# EAGLE design Keyboard01 (EAGLE 4.14)
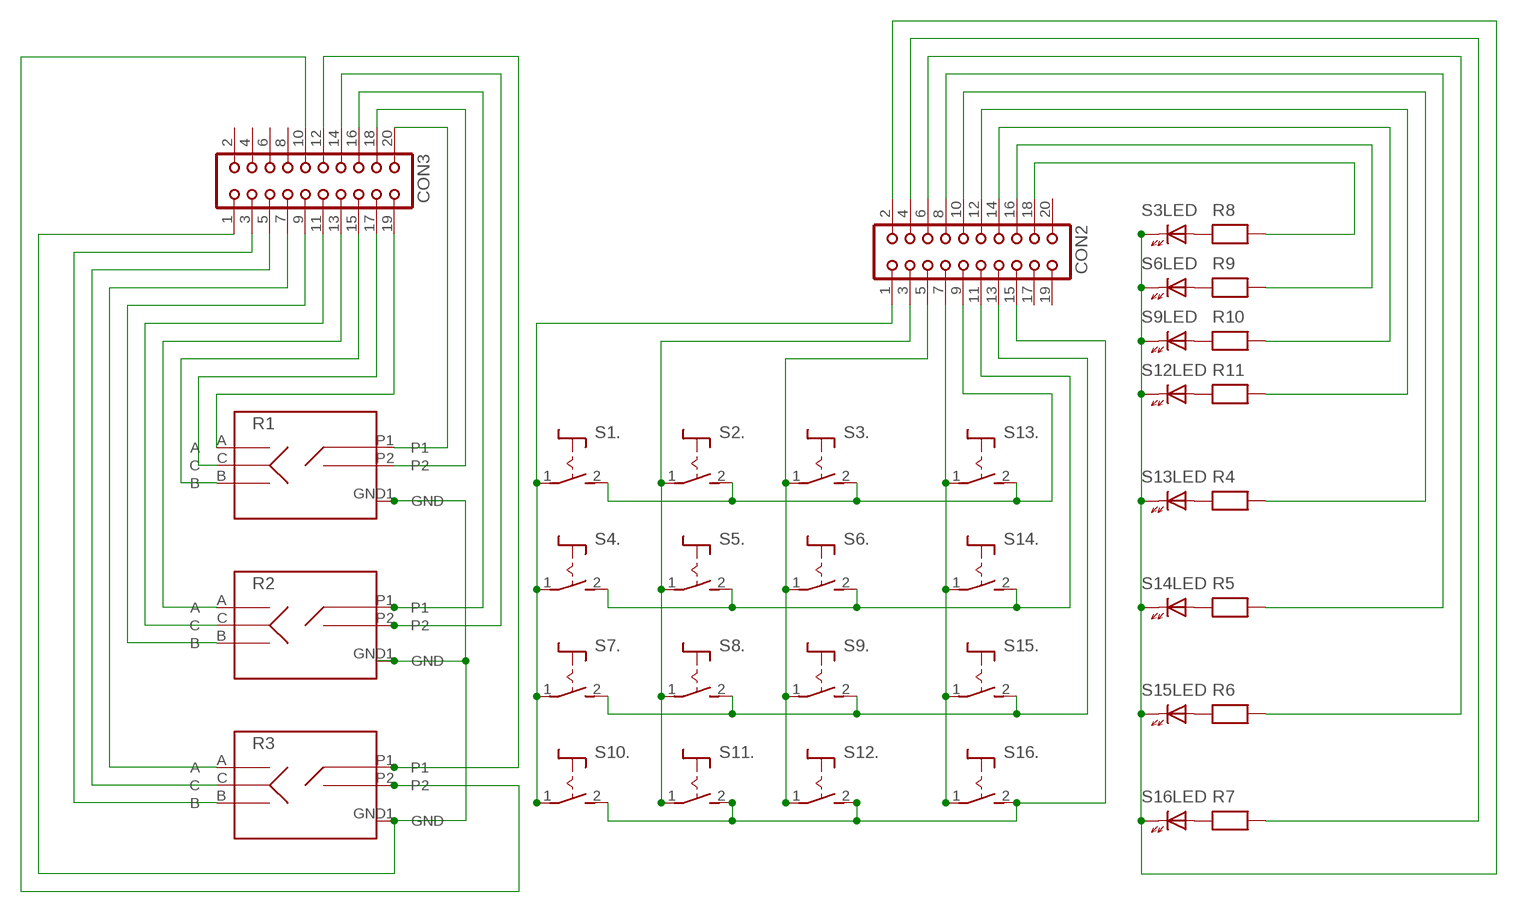
[diagram p0: schematic, sheet 1]

## Parts
CON2  CON20  [CON20]
CON3  CON20  [CON20]
R1  DDM_427  [DDM427]
R2  DDM_427  [DDM427]
R3  DDM_427  [DDM427]
R4  RESEU-10  [R-10]
R5  RESEU-10  [R-10]
R6  RESEU-10  [R-10]
R7  RESEU-10  [R-10]
R8  RESEU-10  [R-10]
R9  RESEU-10  [R-10]
R10  RESEU-10  [R-10]
R11  RESEU-10  [R-10]
S1  MARQ6425  [MARQ6425]
S2  MARQ6425  [MARQ6425]
S3  MARQ6425  [MARQ6425]
S4  MARQ6425  [MARQ6425]
S5  MARQ6425  [MARQ6425]
S6  MARQ6425  [MARQ6425]
S7  MARQ6425  [MARQ6425]
S8  MARQ6425  [MARQ6425]
S9  MARQ6425  [MARQ6425]
S10  MARQ6425  [MARQ6425]
S11  MARQ6425  [MARQ6425]
S12  MARQ6425  [MARQ6425]
S13  MARQ6425  [MARQ6425]
S14  MARQ6425  [MARQ6425]
S15  MARQ6425  [MARQ6425]
S16  MARQ6425  [MARQ6425]

## Nets
N$1: CON2.1 S1.1(.:P) S4.1(.:P) S7.1(.:P) S10.1(.:P)
N$2: CON2.3 S2.1(.:P) S5.1(.:P) S8.1(.:P) S11.1(.:P)
N$3: CON2.5 S3.1(.:P) S6.1(.:P) S9.1(.:P) S12.1(.:P)
N$4: CON2.7 S13.1(.:P) S14.1(.:P) S15.1(.:P) S16.1(.:P)
N$5: CON2.9 S1.2(.:S) S2.2(.:S) S3.2(.:S) S13.2(.:S)
N$6: CON2.11 S4.2(.:S) S5.2(.:S) S6.2(.:S) S14.2(.:S)
N$7: CON2.13 S7.2(.:S) S8.2(.:S) S9.2(.:S) S15.2(.:S)
N$8: CON2.15 S10.2(.:S) S11.2(.:S) S12.2(.:S) S16.2(.:S)
N$9: CON2.10 R4.2
N$10: CON3.17 R1.C
N$11: CON3.15 R1.B
N$12: CON3.13 R2.A
N$13: CON3.11 R2.C
N$14: CON3.9 R2.B
N$15: CON3.7 R3.A
N$16: CON3.5 R3.C
N$17: CON3.3 R3.B
N$18: CON3.20 R1.P1
N$19: CON3.18 R1.P2
N$20: CON3.16 R2.P1
N$21: CON3.14 R2.P2
N$22: CON3.12 R3.P1
N$23: CON3.10 R3.P2
N$24: R4.1 S13.A(LED:A)
N$25: R5.1 S14.A(LED:A)
N$26: R6.1 S15.A(LED:A)
N$27: R7.1 S16.A(LED:A)
N$28: CON2.2 S3.K(LED:K) S6.K(LED:K) S9.K(LED:K) S12.K(LED:K) S13.K(LED:K) S14.K(LED:K) S15.K(LED:K) S16.K(LED:K)
N$29: R8.1 S3.A(LED:A)
N$30: CON2.8 R5.2
N$31: CON2.6 R6.2
N$32: CON2.4 R7.2
N$33: CON3.1 R1.GND1(GND) R2.GND1(GND) R3.GND1(GND)
N$34: R9.1 S6.A(LED:A)
N$35: R10.1 S9.A(LED:A)
N$36: R11.1 S12.A(LED:A)
N$37: CON2.12 R11.2
N$38: CON2.14 R10.2
N$39: CON2.16 R9.2
N$40: CON2.18 R8.2
ROT1: CON3.19 R1.A
Unconnected: CON2.17 CON2.19 CON2.20 CON3.2 CON3.4 CON3.6 CON3.8 S1.A(LED:A) S1.K(LED:K) S2.A(LED:A) S2.K(LED:K) S4.A(LED:A) S4.K(LED:K) S5.A(LED:A) S5.K(LED:K) S7.A(LED:A) S7.K(LED:K) S8.A(LED:A) S8.K(LED:K) S10.A(LED:A) S10.K(LED:K) S11.A(LED:A) S11.K(LED:K)

## Library data of the parts
CON2 CON3 = con-harting:CON20: CONNECTOR
R1-R3 = turbod3:DDM_427
R4-R11 = discrete:RESEU-10
S1-S16 = switch:MARQ6425: DIL SWITCH with LED, Marquardt

## Board
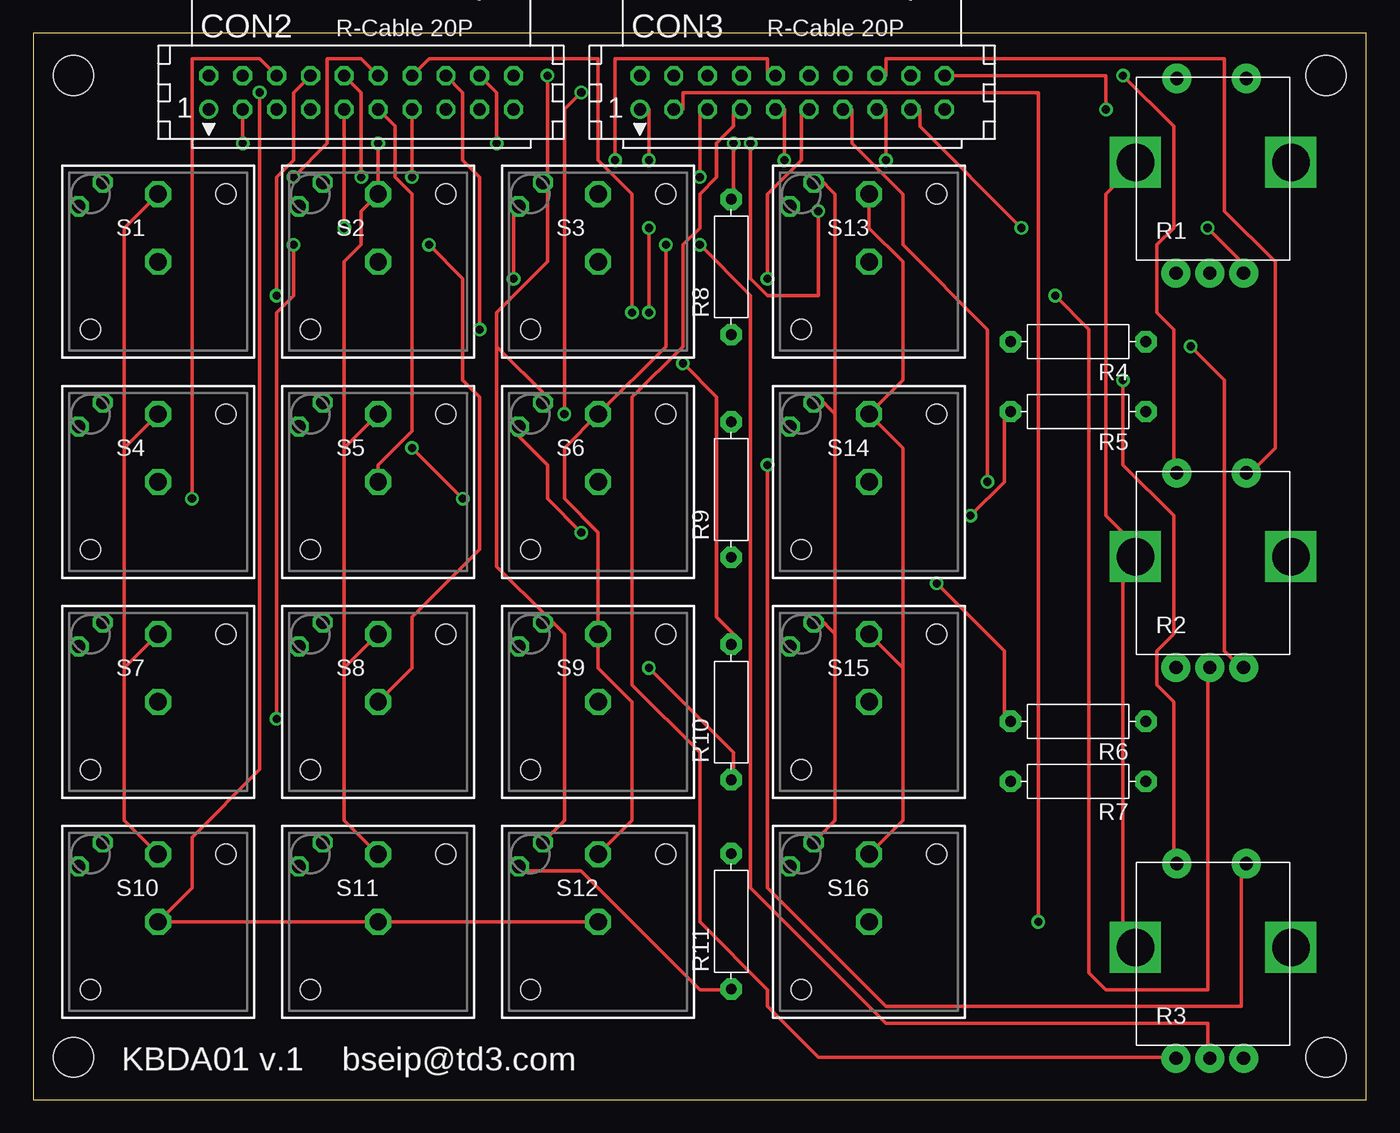
[diagram p1: board, top side]
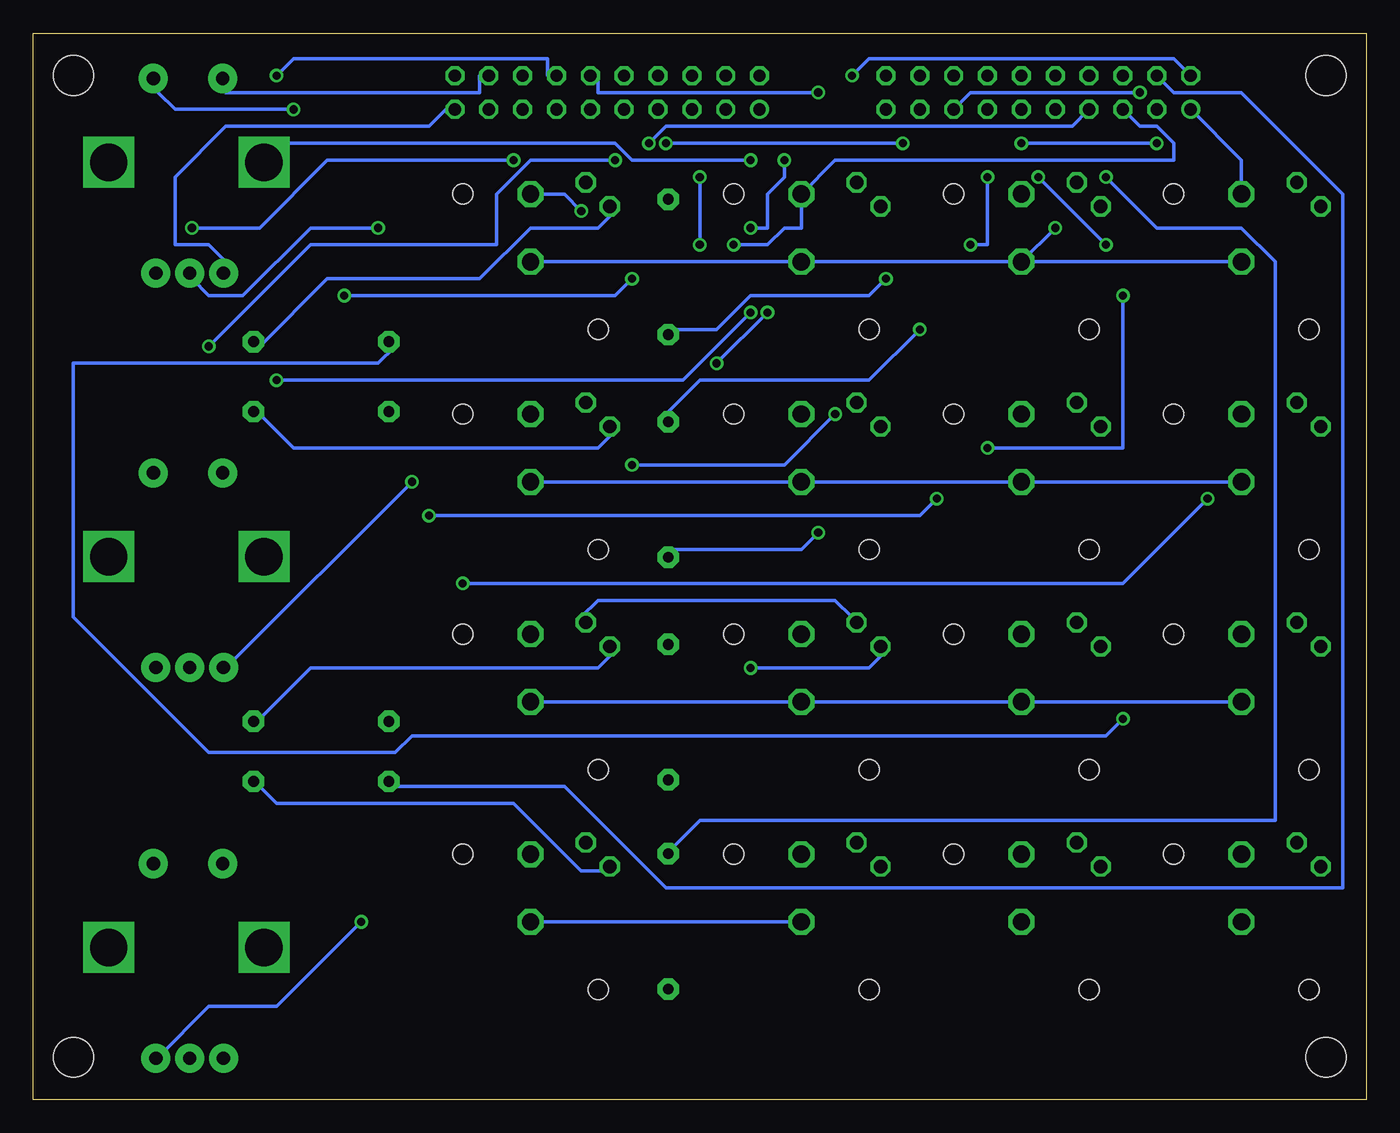
[diagram p2: board, bottom side, seen from below]

Size 100 x 80 mm. Coordinates in mm from the lower left corner, seen from the top.
Outline: 0,0 100,0 100,80 0,80 0,0
Copper layers (1*16): Top 0.035mm / dielectric 1.5mm / Bottom 0.035mm
Design rules "default": minimum track width 10mil, minimum drill 24mil, track to track 8mil, track to pad 8mil, pad to pad 8mil, via to via 8mil, smd to smd 8mil, copper to edge 40mil, drill to drill 8mil, minimum pad ring 10mil, minimum via ring 8mil, stop-mask expansion 4mil, vias tented up to drill 0mil, thermal gap 10mil
Holes 3 mm at 3.01,3.17 96.99,3.17 96.99,76.83 3.01,76.83

### Footprints (pad centres in the part's own frame; a part is rotated, then mirrored left to right if it is on the bottom)
CON20 = drill 0.914 round: 1 -11.43,-1.27 | drill 0.914 octagon: 2 -11.43,1.27; 3 -8.89,-1.27; 4 -8.89,1.27; 5 -6.35,-1.27; 6 -6.35,1.27; 7 -3.81,-1.27; 8 -3.81,1.27; 9 -1.27,-1.27; 10 -1.27,1.27; 11 1.27,-1.27; 12 1.27,1.27; 13 3.81,-1.27; 14 3.81,1.27; 15 6.35,-1.27; 16 6.35,1.27; 17 8.89,-1.27; 18 8.89,1.27; 19 11.43,-1.27; 20 11.43,1.27
DDM427 = drill 1 pad 2.184 round: A 2.98,-0.96; B 8.06,-0.96; C 5.52,-0.96; P1 8.25,13.64; P2 3.04,13.64 | drill 2.8 pad 3.81 square: GND1 -0.06,7.35; GND2 11.6,7.35
R-10 = drill 0.813 pad 1.6 octagon: 1 -5.08,0; 2 5.08,0
MARQ6425 = drill 1.3 octagon: 1 0,5.08; 2 0,0 | drill 1 octagon: A -5.95,4.15; K -4.15,5.95 | hole 1.5: 5.08,5.08; -5.08,-5.08

### Placement (x,y rotation side)
CON2  24.6,75.56 0 top
CON3  56.94,75.56 0 top
R1  82.75,62.97 0 top
R2  82.75,33.38 0 top
R3  82.75,4.06 0 top
R4  78.4,56.86 180 top
R5  78.4,51.62 180 top
R6  78.4,28.38 180 top
R7  78.4,23.87 180 top
R8  52.36,62.47 90 top
R9  52.36,45.77 90 top
R10  52.36,29.07 90 top
R11  52.36,13.37 90 top
S1  9.36,62.86 0 top
S2  25.87,62.86 0 top
S3  42.38,62.86 0 top
S4  9.36,46.35 0 top
S5  25.87,46.35 0 top
S6  42.38,46.35 0 top
S7  9.36,29.84 0 top
S8  25.87,29.84 0 top
S9  42.38,29.84 0 top
S10  9.36,13.33 0 top
S11  25.87,13.33 0 top
S12  42.38,13.33 0 top
S13  62.7,62.86 0 top
S14  62.7,46.35 0 top
S15  62.7,29.84 0 top
S16  62.7,13.33 0 top

### Tracks (layer width: path | path; a pad name or v marks a point on that pad's centre or on a via)
N$1
  Top 0.254: S10.1 6.82,20.95 6.82,32.38 | 6.82,32.38 S7.1 | 6.82,48.89 S4.1 | 6.82,32.38 6.82,48.89 | S1.1 6.82,65.4 6.82,48.89
  Bottom 0.254: CON2.1 9.36,70.48 S1.1
N$2  (via drill 0.61)
  Top 0.254: v15.71,71.75 CON2.3 | v25.87,71.75 S2.1 24.6,66.67 24.6,64.13 23.33,62.86 23.33,48.89 | S11.1 23.33,20.95 23.33,32.38 | 23.33,32.38 S8.1 | 23.33,48.89 S5.1 | 23.33,32.38 23.33,48.89
  Bottom 0.254: v25.87,71.75 v15.71,71.75
N$3  (via drill 0.61)
  Top 0.254: S12.1 44.92,20.95 44.92,29.84 42.38,32.38 S9.1 42.38,42.54 39.84,45.08 39.84,48.89 S6.1 47.46,56.51 v47.46,64.13
  Bottom 0.254: CON2.5 16.98,73.02 15.71,73.02 14.44,71.75 14.44,70.48 39.84,70.48 S3.1 42.38,65.4 43.65,65.4 44.92,64.13 v47.46,64.13
N$4  (via drill 0.61)
  Top 0.254: S16.1 65.24,20.95 65.24,32.38 | 65.24,32.38 S15.1 | 65.24,32.38 65.24,48.89 S14.1 65.24,53.97 65.24,62.86 62.7,65.4 S13.1 | v53.81,71.75 53.81,61.59 55.08,60.32 58.89,60.32 v58.89,66.67
  Bottom 0.254: CON2.7 22.06,73.02 52.54,73.02 v53.81,71.75 | v58.89,66.67 60.16,67.94 S13.1
N$5  (via drill 0.61)
  Top 0.254: v23.33,65.4 CON2.9
  Bottom 0.254: S2.2 v23.33,65.4 | S1.2 S2.2 | S2.2 S3.2 S13.2
N$6
  Top 0.254: CON2.11 27.14,73.02 27.14,69.21 28.41,67.94 28.41,50.16 25.87,47.62 S5.2
  Bottom 0.254: S4.2 S5.2 S6.2 S14.2
N$7  (via drill 0.61)
  Top 0.254: v28.41,69.21 CON2.13 | v29.68,64.13 32.22,61.59 32.22,53.97 33.49,52.7 33.49,41.27 28.41,36.19 28.41,32.38 S8.2
  Bottom 0.254: v28.41,69.21 28.41,64.13 v29.68,64.13 | S7.2 S8.2 S9.2 S15.2
N$8  (via drill 0.61)
  Top 0.254: v16.98,75.56 16.98,24.76 11.9,19.68 11.9,15.87 S10.2 S11.2 S12.2
  Bottom 0.254: CON2.15 29.68,75.56 v16.98,75.56 | S12.2 S16.2
N$9  (via drill 0.61)
  Top 0.254: CON2.10 24.6,75.56 v24.6,69.21 | v19.52,64.13 19.52,60.32 18.25,59.05 v18.25,28.57
  Bottom 0.254: v19.52,64.13 v24.6,69.21 | v18.25,28.57 19.52,27.3 71.59,27.3 72.86,26.03 86.83,26.03 96.99,36.19 96.99,55.24 74.13,55.24 72.86,56.51 R4.2
N$10  (via drill 0.61)
  Top 0.254: v74.13,65.4 66.51,73.02 66.51,74.29 CON3.17
  Bottom 0.254: v74.13,65.4 79.21,65.4 84.29,60.32 86.83,60.32 88.1,61.59 R1.C
N$11  (via drill 0.61)
  Top 0.254: v63.97,70.48 63.97,74.29 CON3.15 | v88.1,65.4 90.64,62.86 R1.B
  Bottom 0.254: v63.97,70.48 77.94,70.48 83.02,65.4 v88.1,65.4
N$12  (via drill 0.61)
  Top 0.254: v71.59,46.35 71.59,57.78 65.24,64.13 65.24,67.94 61.43,71.75 61.43,74.29 CON3.13
  Bottom 0.254: v71.59,46.35 85.56,32.38 R2.A
N$13  (via drill 0.61)
  Top 0.254: v55.08,61.59 55.08,67.94 57.62,70.48 57.62,74.29 CON3.11 | v76.67,60.32 79.21,57.78 79.21,9.52 80.48,8.25 88.1,8.25 88.1,32.38 R2.C
  Bottom 0.254: v55.08,61.59 56.35,60.32 v76.67,60.32
N$14  (via drill 0.61)
  Top 0.254: v56.35,70.48 56.35,74.29 CON3.9 | v86.83,56.51 89.37,53.97 89.37,33.65 90.64,32.38 R2.B
  Bottom 0.254: v56.35,70.48 62.7,70.48 65.24,67.94 65.24,64.13 79.21,64.13 v86.83,56.51
N$15
  Top 0.254: CON3.7 52.54,74.29 52.54,73.02 51.27,71.75 51.27,69.21 50,67.94 50,65.4 48.73,64.13 48.73,56.51 44.92,52.7 44.92,31.11 50,26.03 50,13.33 55.08,8.25 55.08,6.98 58.89,3.17 85.56,3.17 R3.A
N$16  (via drill 0.61)
  Top 0.254: v50,69.21 50,74.29 CON3.5 | v50,64.13 53.81,60.32 53.81,15.87 63.97,5.71 88.1,5.71 88.1,3.17 R3.C
  Bottom 0.254: v50,64.13 v50,69.21
N$17  (via drill 0.61)
  Top 0.254: v75.4,13.33 75.4,75.56 48.73,75.56 48.73,74.29 CON3.3
  Bottom 0.254: v75.4,13.33 81.75,6.98 86.83,6.98 90.64,3.17 R3.B
N$18  (via drill 0.61)
  Top 0.254: v80.48,74.29 80.48,76.83 CON3.20
  Bottom 0.254: v80.48,74.29 89.37,74.29 90.64,75.56 R1.P1
N$19
  Bottom 0.254: CON3.18 66.51,76.83 66.51,75.56 85.56,75.56 R1.P2
N$20
  Top 0.254: CON3.16 63.97,76.83 63.97,78.1 89.37,78.1 89.37,66.67 93.18,62.86 93.18,48.89 91.91,47.62 R2.P1
N$21  (via drill 0.61)
  Top 0.254: v81.75,76.83 85.56,73.02 85.56,65.4 84.29,64.13 84.29,59.05 85.56,57.78 85.56,47.62 R2.P2
  Bottom 0.254: v81.75,76.83 80.48,78.1 61.43,78.1 61.43,76.83 CON3.14
N$22  (via drill 0.61)
  Top 0.254: v41.11,75.56 39.84,74.29 v39.84,51.43 | v55.08,47.62 55.08,15.87 63.97,6.98 90.64,6.98 90.64,17.14 R3.P1
  Bottom 0.254: v41.11,75.56 57.62,75.56 57.62,76.83 CON3.12 | v39.84,51.43 43.65,47.62 v55.08,47.62
N$23  (via drill 0.61)
  Top 0.254: v43.65,70.48 43.65,78.1 55.08,78.1 55.08,76.83 CON3.10 | v46.19,59.05 v46.19,65.4 | v81.75,53.97 81.75,47.62 85.56,43.81 85.56,34.92 84.29,33.65 84.29,31.11 85.56,29.84 85.56,18.41 R3.P2
  Bottom 0.254: v43.65,70.48 43.65,69.21 44.92,67.94 44.92,65.4 v46.19,65.4 | v46.19,59.05 51.27,53.97 v81.75,53.97
N$24
  Bottom 0.254: S13.A 56.35,66.67 57.62,65.4 62.7,65.4 66.51,61.59 77.94,61.59 83.02,56.51 R4.1
N$25
  Bottom 0.254: S14.A 56.35,50.16 57.62,48.89 80.48,48.89 83.02,51.43 R5.1
N$26
  Bottom 0.254: S15.A 56.35,33.65 57.62,32.38 79.21,32.38 83.02,28.57 R6.1
N$27
  Bottom 0.254: S16.A 56.35,17.14 58.89,17.14 63.97,22.22 81.75,22.22 83.02,23.49 R7.1
N$28  (via drill 0.61)
  Top 0.254: 60.16,34.92 60.16,20.95 58.89,19.68 S16.K | 60.16,34.92 58.89,36.19 S15.K | 60.16,51.43 58.89,52.7 S14.K | 60.16,34.92 60.16,51.43 | 60.16,51.43 60.16,67.94 58.89,69.21 S13.K | 38.57,36.19 39.84,34.92 39.84,20.95 38.57,19.68 S12.K | 38.57,69.21 v38.57,76.83 | 34.76,56.51 38.57,52.7 S6.K | 34.76,56.51 34.76,59.05 38.57,62.86 38.57,69.21 | 38.57,69.21 S3.K | 38.57,36.19 34.76,40 34.76,56.51 | 38.57,36.19 S9.K
  Bottom 0.254: CON2.2 14.44,78.1 37.3,78.1 v38.57,76.83 | S15.K 58.89,36.19 57.62,37.46 39.84,37.46 38.57,36.19 S9.K
N$29  (via drill 0.61)
  Top 0.254: v36.03,61.59 36.03,66.67 S3.A
  Bottom 0.254: v36.03,61.59 37.3,60.32 46.19,60.32 48.73,57.78 52.54,57.78 R8.1
N$30  (via drill 0.61)
  Top 0.254: CON2.8 19.52,75.56 19.52,70.48 18.25,69.21 v18.25,60.32 | v28.41,48.89 v32.22,45.08 | v70.32,43.81 72.86,46.35 72.86,51.43 R5.2
  Bottom 0.254: v18.25,60.32 18.25,48.89 v28.41,48.89 | v32.22,45.08 33.49,43.81 v70.32,43.81
N$31  (via drill 0.61)
  Top 0.254: CON2.6 16.98,78.1 11.9,78.1 v11.9,45.08 | v67.78,38.73 72.86,33.65 72.86,28.57 R6.2
  Bottom 0.254: v11.9,45.08 18.25,38.73 v67.78,38.73
N$32
  Bottom 0.254: CON2.4 14.44,75.56 9.36,75.56 1.74,67.94 1.74,15.87 52.54,15.87 60.16,23.49 72.86,23.49 R7.2
N$33  (via drill 0.61)
  Top 0.254: R3.GND1 81.75,12.06 81.75,40 R2.GND1 81.75,42.54 80.48,43.81 80.48,67.94 81.75,69.21 R1.GND1 | v46.19,70.48 46.19,74.29 CON3.1
  Bottom 0.254: v46.19,70.48 55.08,70.48 56.35,71.75 81.75,71.75 R1.GND1
N$34  (via drill 0.61)
  Top 0.254: v41.11,42.54 38.57,45.08 38.57,47.62 36.03,50.16 S6.A
  Bottom 0.254: v41.11,42.54 42.38,41.27 52.54,41.27 R9.1
N$35  (via drill 0.61)
  Top 0.254: v46.19,32.38 52.54,26.03 52.54,24.76 R10.1
  Bottom 0.254: v46.19,32.38 37.3,32.38 36.03,33.65 S9.A
N$36
  Top 0.254: S12.A 36.03,17.14 41.11,17.14 50,8.25 52.54,8.25 R11.1
N$37  (via drill 0.61)
  Top 0.254: CON2.12 24.6,78.1 22.06,78.1 22.06,71.75 v19.52,69.21
  Bottom 0.254: v19.52,69.21 15.71,65.4 9.36,65.4 6.82,62.86 6.82,20.95 50,20.95 52.54,18.41 R11.2
N$38  (via drill 0.61)
  Top 0.254: CON2.14 29.68,78.1 42.38,78.1 42.38,70.48 44.92,67.94 v44.92,59.05 | v48.73,55.24 51.27,52.7 51.27,36.19 52.54,34.92 R10.2
  Bottom 0.254: v48.73,55.24 v44.92,59.05
N$39  (via drill 0.61)
  Top 0.254: CON2.16 32.22,75.56 32.22,70.48 33.49,69.21 v33.49,57.78
  Bottom 0.254: v33.49,57.78 37.3,53.97 50,53.97 52.54,51.43 R9.2
N$40  (via drill 0.61)
  Top 0.254: CON2.18 34.76,75.56 v34.76,71.75 | v52.54,71.75 52.54,67.94 R8.2
  Bottom 0.254: v34.76,71.75 v52.54,71.75
ROT1
  Bottom 0.254: CON3.19 69.05,74.29 70.32,73.02 85.56,73.02 89.37,69.21 89.37,64.13 86.83,64.13 85.56,62.86 R1.A

### Text on the board
tPlace: KBDA01 v.1 bseip@td3.com